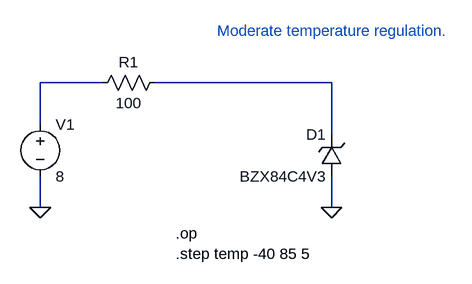
[diagram p0: schematic zener.asc]
zener.asc, the LTspice schematic file:
Version 4
SHEET 1 880 680
WIRE -48 48 -144 48
WIRE 304 48 32 48
WIRE -144 112 -144 48
WIRE 304 128 304 48
WIRE -144 240 -144 192
WIRE 304 240 304 192
FLAG -144 240 0
FLAG 304 240 0
SYMBOL voltage -144 96 R0
WINDOW 123 0 0 Left 0
WINDOW 39 0 0 Left 0
SYMATTR InstName V1
SYMATTR Value 8
SYMBOL res 48 32 R90
WINDOW 0 0 56 VBottom 2
WINDOW 3 32 56 VTop 2
SYMATTR InstName R1
SYMATTR Value 100
SYMBOL zener 320 192 R180
WINDOW 0 24 64 Left 2
WINDOW 3 24 0 Left 2
SYMATTR InstName D1
SYMATTR Value BZX84C4V3
SYMATTR Description Diode
SYMATTR Type diode
TEXT 64 280 Left 2 !.op\n.step temp -40 85 5
TEXT 128 -32 Left 2 ;Moderate temperature regulation.

The netlist it stands for:
* zener.asc
V1 N001 0 8
R1 N002 N001 100
D1 0 N002 BZX84C4V3
.model D D
.lib standard.dio
.op
.step temp -40 85 5
* Moderate temperature regulation.
.backanno
.end